# Altium schematic sheet PowerDelivery.SchDoc
size B; SheetNumber: 7; SheetTotal: 7
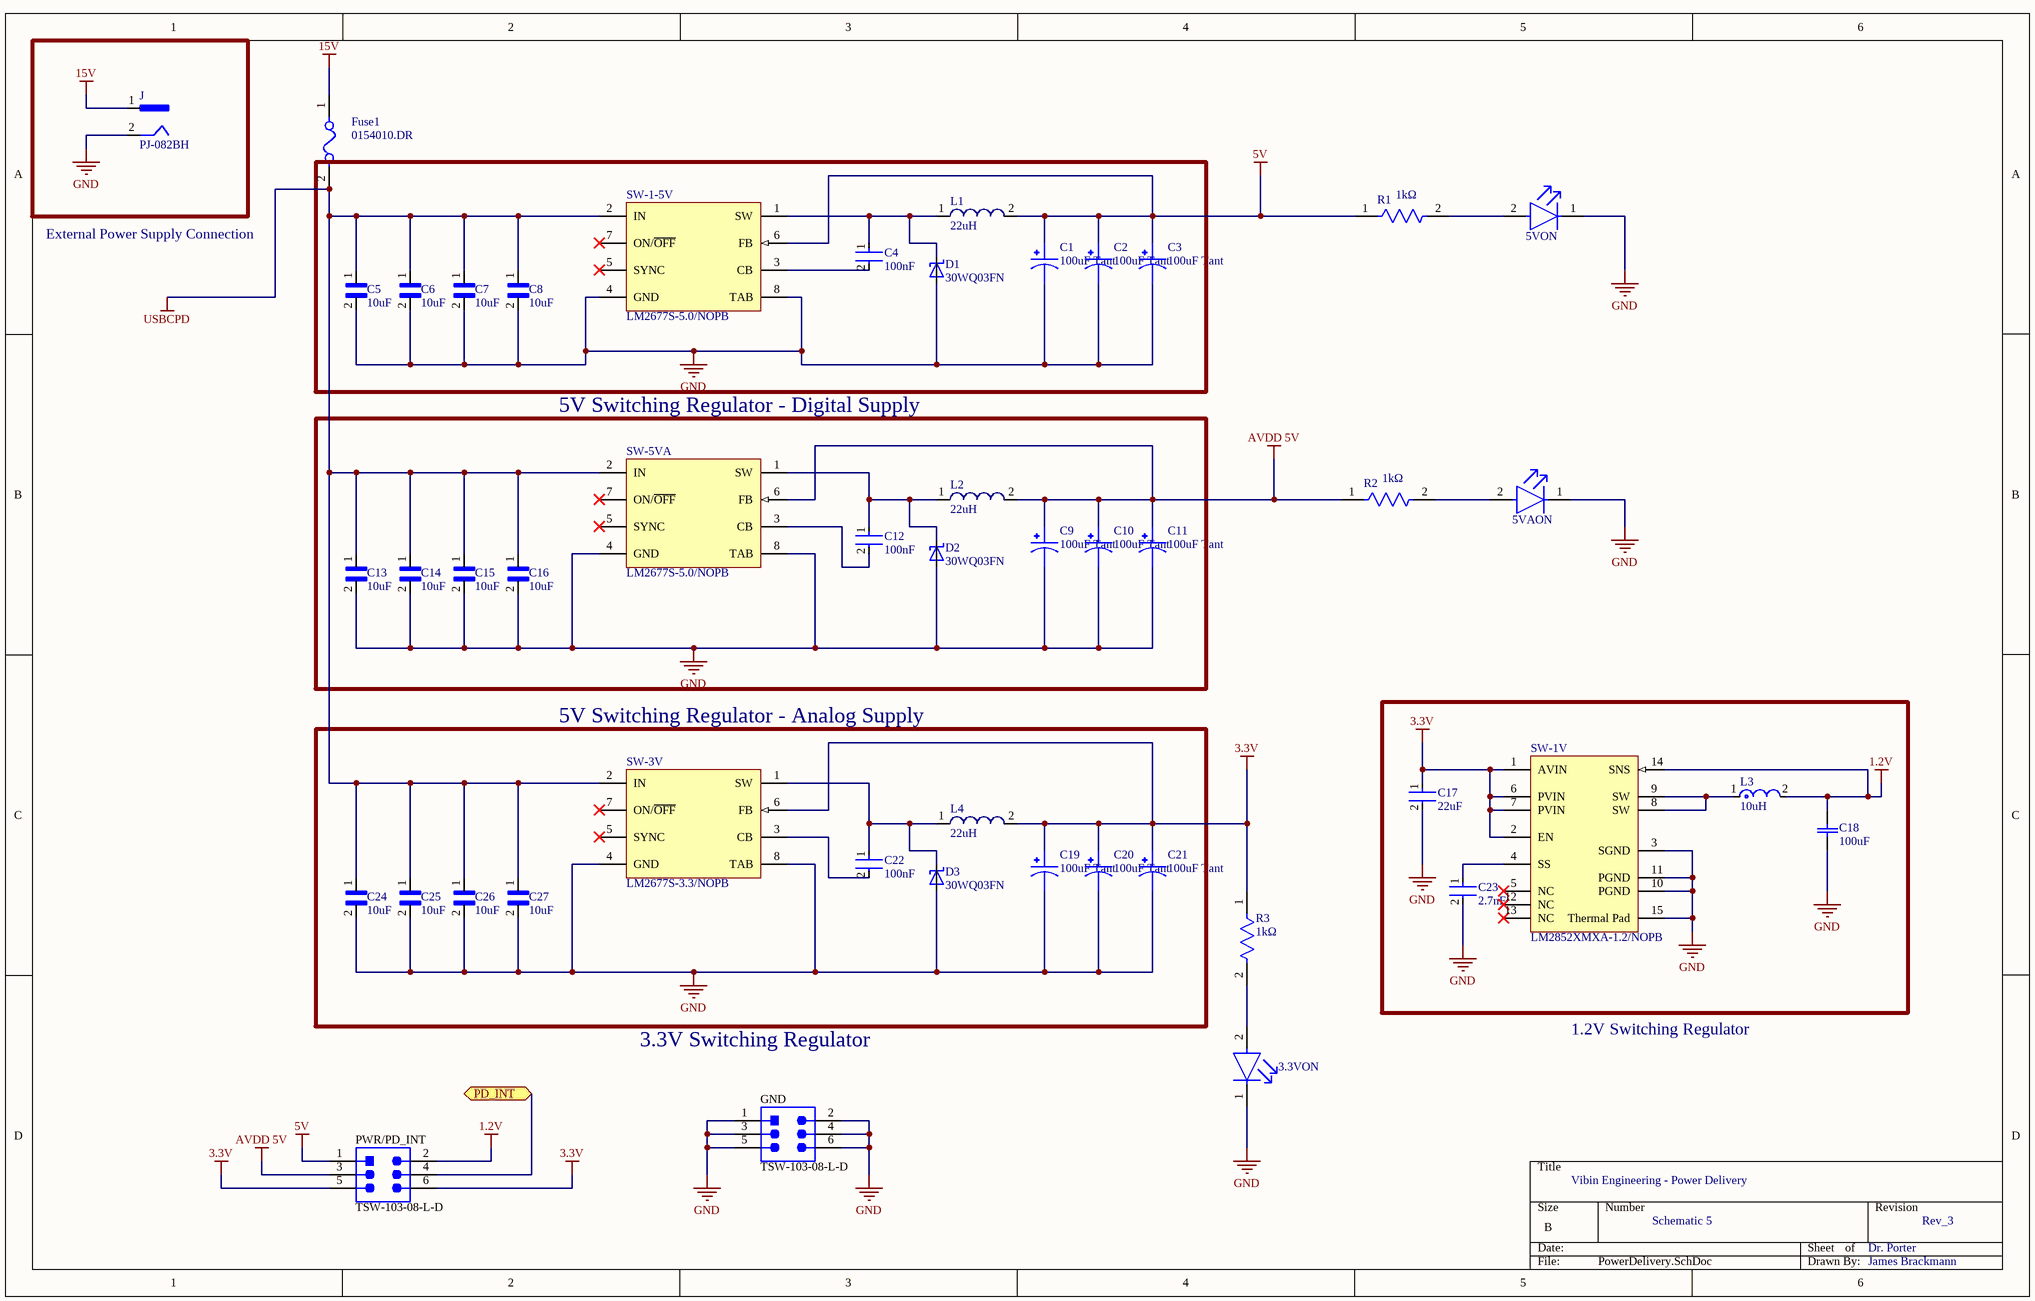
[diagram p0: PowerDelivery.SchDoc]

## Parts
3.3VON  LTST-C190GKT  [FP-LTST-C190GKT-MFG]  (value not drawn)
5VAON  LTST-C190GKT  [FP-LTST-C190GKT-MFG]  (value not drawn)
5VON  LTST-C190GKT  [FP-LTST-C190GKT-MFG]  (value not drawn)
C1  100uF Tant  [CAPPM7343X310N]
C2  100uF Tant  [CAPPM7343X310N]
C3  100uF Tant  [CAPPM7343X310N]
C4  100nF  [FP-CC0603-DA-MFG]
C5  10uF  [CAPPM7343X310N]
C6  10uF  [CAPPM7343X310N]
C7  10uF  [CAPPM7343X310N]
C8  10uF  [CAPPM7343X310N]
C9  100uF Tant  [CAPPM7343X310N]
C10  100uF Tant  [CAPPM7343X310N]
C11  100uF Tant  [CAPPM7343X310N]
C12  100nF  [FP-CC0603-DA-MFG]
C13  10uF  [CAPPM7343X310N]
C14  10uF  [CAPPM7343X310N]
C15  10uF  [CAPPM7343X310N]
C16  10uF  [CAPPM7343X310N]
C17  22uF  [FP-GRM21B-0_15-MFG]
C18  100uF  [CAPCP3216X180N]
C19  100uF Tant  [CAPPM7343X310N]
C20  100uF Tant  [CAPPM7343X310N]
C21  100uF Tant  [CAPPM7343X310N]
C22  100nF  [FP-CC0603-DA-MFG]
C23  2.7nF  [FP-C0402-BB-MFG]
C24  10uF  [CAPPM7343X310N]
C25  10uF  [CAPPM7343X310N]
C26  10uF  [CAPPM7343X310N]
C27  10uF  [CAPPM7343X310N]
D1  30WQ03FN  [TO-252AA]
D2  30WQ03FN  [TO-252AA]
D3  30WQ03FN  [TO-252AA]
Fuse1  0154010.DR  [FP-0154-MFG]
GND  TSW-103-08-L-D  [SMTC-TSW-103-08-L-D_V]
J  PJ-082BH  [CUI_PJ-082BH]
L1  22uH  [WE-PD2SR 7850]
L2  22uH  [WE-PD2SR 7850]
L3  10uH  [FP-DEM8045C-MFG]
L4  22uH  [WE-PD2SR 7850]
PWR/PD_INT  TSW-103-08-L-D  [SMTC-TSW-103-08-L-D_V]
R1  1kΩ  [FP-CRCW0603-e3-MFG]
R2  1kΩ  [FP-CRCW0603-e3-MFG]
R3  1kΩ  [FP-CRCW0603-e3-MFG]
SW-1-5V  LM2677S-5.0/NOPB  [KTW0007B_N]
SW-1V  LM2852XMXA-1.2/NOPB  [MXA14A_M]
SW-3V  LM2677S-3.3/NOPB  [KTW0007B_M]
SW-5VA  LM2677S-5.0/NOPB  [KTW0007B_N]

## Blocks framed on the sheet
5V Switching Regulator - Digital Supply: C9-C16 D2 L2 SW-5VA
5V Switching Regulator - Analog Supply: C19-C22 C24-C27 D3 L4 SW-3V

## Ports
PD_INT (bidir)

## Nets
1.2V: C18.2(C2) L3.2 PWR/PD_INT.2 SW-1V.14(SNS)
3.3V: C17.1 C19.1 C20.1 C21.1 L4.2 PWR/PD_INT.5 PWR/PD_INT.6 R3.1 SW-1V.1(AVIN) SW-1V.2(EN) SW-1V.6(PVIN) SW-1V.7(PVIN) SW-3V.6(FB)
5V: C1.1 C2.1 C3.1 L1.2 PWR/PD_INT.1 R1.1 SW-1-5V.6(FB)
15V: Fuse1.1 J.1
AVDD 5V: C9.1 C10.1 C11.1 L2.2 PWR/PD_INT.3 R2.1 SW-5VA.6(FB)
GND: 3.3VON.1(C) 5VAON.1(C) 5VON.1(C) C1.2 C2.2 C3.2 C5.2 C6.2 C7.2 C8.2 C9.2 C10.2 C11.2 C13.2 C14.2 C15.2 C16.2 C17.2 C18.1(C1) C19.2 C20.2 C21.2 C23.2 C24.2 C25.2 C26.2 C27.2 D1.1(A1) D2.1(A1) D3.1(A1) GND.1 GND.2 GND.3 GND.4 GND.5 GND.6 J.2 SW-1-5V.4(GND) SW-1-5V.8(TAB) SW-1V.3(SGND) SW-1V.10(PGND) SW-1V.11(PGND) SW-1V.15(Thermal_Pad) SW-3V.4(GND) SW-3V.8(TAB) SW-5VA.4(GND) SW-5VA.8(TAB)
USBCPD: C5.1 C6.1 C7.1 C8.1 C13.1 C14.1 C15.1 C16.1 C24.1 C25.1 C26.1 C27.1 Fuse1.2 SW-1-5V.2(IN) SW-3V.2(IN) SW-5VA.2(IN)
PD_INT: PWR/PD_INT.4 ; port PD_INT
Net3.3VON_2: 3.3VON.2(A) R3.2
Net5VAON_2: 5VAON.2(A) R2.2
Net5VON_2: 5VON.2(A) R1.2
NetC4_1: C4.1 D1.3(C) L1.1 SW-1-5V.1(SW)
NetC4_2: C4.2 SW-1-5V.3(CB)
NetC12_1: C12.1 D2.3(C) L2.1 SW-5VA.1(SW)
NetC12_2: C12.2 SW-5VA.3(CB)
NetC22_1: C22.1 D3.3(C) L4.1 SW-3V.1(SW)
NetC22_2: C22.2 SW-3V.3(CB)
NetC23_1: C23.1 SW-1V.4(SS)
NetL3_1: L3.1 SW-1V.8(SW) SW-1V.9(SW)

Not connected (* = marked no-connect by the designer): D1 2(A2); D2 2(A2); D3 2(A2); SW-1-5V 5(SYNC)* 7(ON/~{OFF})*; SW-1V 5(NC)* 12(NC)* 13(NC)*; SW-3V 5(SYNC)* 7(ON/~{OFF})*; SW-5VA 5(SYNC)* 7(ON/~{OFF})*

## Notes on the sheet
- External Power Supply Connection
- 3.3V Switching Regulator
- 1.2V Switching Regulator
- Vibin Engineering - Power Delivery
- Schematic 5
- Dr. Porter
- Rev_3
- James Brackmann

## Library data of the parts
3.3VON 5VAON 5VON = CMP-22017-000005-2: LED GREEN CLEAR CHIP SMD       LTST-C190GKT; Dominant Wavelength: 569nm; Reverse Voltage: 5V; Lens Color: Colorless; Viewing Angle: 130°; Voltage: 2V; Forward Current: 30mA; Power Dissipation: 100mW; Luminous Intensity: 6mcd; Number of LEDs: 1; Forward Voltage: 2.1V; Wavelength: 565nm; Test Current: 10mA; Min Operating Temperature: -55°C; Lens Style: Clear; Mount: Surface Mount; Width: 0.8mm; Packaging: Tape and Reel; Lens Transparency: Clear; Case Code (Metric): 1608; Depth: 0.8mm; Case Code (Imperial): 0603; Case/Package: 0603; Number of Pins: 2; Max Operating Temperature: 85°C; Lead Free: Lead Free; Number of Elements: 1; Length: 1.6mm; Height: 0.8mm; Package Quantity: 1; Power Rating: 100mW; Radiation Hardening: No; Illumination Color: Green; Color: Green
C1 C9 C19 = TPSD107K010R0065: 100 ÂµF Molded Tantalum Capacitors 10 V 2917 (7343 Metric) 65mOhm / TPSD107K010R0065; MF: AVX; Check_prices: https://www.snapeda.com/parts/TPSD107K010R0065/AVX/view-part/?ref=eda; SnapEDA_Link: https://www.snapeda.com/parts/TPSD107K010R0065/AVX/view-part/?ref=snap; Package: 2917 AVX; Value: *; MP: TPSD107K010R0065; Digi-Key_Part_Number: 478-1776-2-ND; Purchase-URL: https://pricing.snapeda.com/search/part/TPSD107K010R0065/?ref=eda
C2 C3 C10 C11 C20 C21 = TPSD107K010R0065: 100 ÂµF Molded Tantalum Capacitors 10 V 2917 (7343 Metric) 65mOhm; MF: AVX; Check_prices: https://www.snapeda.com/parts/TPSD107K010R0065/AVX/view-part/?ref=eda; SnapEDA_Link: https://www.snapeda.com/parts/TPSD107K010R0065/AVX/view-part/?ref=snap; Package: 2917 AVX; Value: *; MP: TPSD107K010R0065; Digi-Key_Part_Number: 478-1776-2-ND; Purchase-URL: https://pricing.snapeda.com/search/part/TPSD107K010R0065/?ref=eda
C4 C12 C22 = CMP-2100-03600-2: CAP CER 10000PF 50V X7R 0603      CC0603KRX7R9BB103; Manufacturer: YAGEO; Tolerance: 0.1; Material: Ceramic; Temperature Coefficient: 15%; Value: 10 nF; Mouser Description: Multilayer Ceramic Capacitor, CC Series, 0.01 - F, - 10%, X7R, 50 V, 0603 [1608 Metric]; Digikey Description: CAP CER 10000PF 50V X7R 0603; Height: 0.9mm; Category: Cap; Temperature Characteristic: X7R; Footprint Url: http://www.yageo.com/exep/pages/download/literatures/UPY-C_GEN_24.pdf; Lead Free: Yes; Voltage Rating: 50 V; Manufacturer Part Number: CC0603KRX7R9BB103; Temperature: -55°C to +125°C; Device Class L3: Ceramic Capacitors; ComponentLink2Description: Datasheet; Voltage: 50 V; Package: CC0603-DA; Octopart: https://octopart.com/cc0603krx7r9bb103-yageo-192938; Automotive: No; Temperature Range High: +125°C; Temperature Range Low: -55°C; RoHS: TRUE; Device Class L1: Passive Components; ComponentLink2URL: http://www.yageo.com/documents/recent/UPY-GPHC_X7R_6.3V-to-50V_18.pdf; Device Class L2: Capacitors; Capacitance: 10 nF
C5-C8 C13-C16 C24-C27 = T495D106M035ATE300: Cap Tant Solid 10uF 35V D CASE 20% _7.3 X 4.3 X 2.8mm_ SMD 7343-31 0.3 Ohm 125C Automotive T/R      T495D106M035ATE300; MF: Kemet; SnapEDA_Link: https://www.snapeda.com/parts/T495D106M035ATE300/Kemet/view-part/560949/?ref=snap; MP: T495D106M035ATE300; Price: None; Value: *; Availability: Unavailable; Package: 2917 Kemet
C17 = CMP-2007-03385-2: Chip Multilayer Ceramic Capacitors for General Purpose, 0805, 22uF, X5R, 15%, 20%, 6.3V       GRM21BR60J226ME39L; Material: Ceramic; Max Operating Temperature: 85°C; Voltage: 6.3V; Min Operating Temperature: -55°C; Case/Package: 0805; Thickness: 0.053inch; Dielectric: X5R; Packaging: Tape and Reel; Depth: 1.25mm; Termination: SMD/SMT; Voltage Rating (DC): 6.3V; Radiation Hardening: No; Tolerance: 20%; Mount: Surface Mount; Lead Free: Lead Free; Package Quantity: 1; REACH SVHC: No SVHC; Voltage Rating: 6.3V; Capacitance: 22uF; Length: 2mm; Case Code (Imperial): 0805; Case Code (Metric): 2012; Width: 0.049inch; Height: 1.25mm
C18 = TCJA107M004R0200: 100ÂµF Molded Tantalum Polymer Capacitor 4V 1206 (3216 Metric) 200mOhm @ 100kHz          TCJA107M004R0200; MF: AVX; Check_prices: https://www.snapeda.com/parts/TCJA107M004R0200/AVX/view-part/607617/?ref=eda; Availability: In Stock; Price: None; Package: 1206 AVX Corporation; MP: TCJA107M004R0200; Value: *; SnapEDA_Link: https://www.snapeda.com/parts/TCJA107M004R0200/AVX/view-part/607617/?ref=snap; Purchase-URL: https://pricing.snapeda.com/search/part/TCJA107M004R0200/?ref=eda
C23 = CMP-2008-03164-3: C0402 2,700 pF X7R 5.00% 10 V        C0402C272J8RACAUTO; Manufacturer: Kemet; Material: Ceramic; Tolerance: 0.05; Temperature Coefficient: 15%; Voltage Rating: 10 V; Octopart: https://octopart.com/c0402c272j8racauto-kemet-16435644; Manufacturer Part Number: C0402C272J8RACAUTO; Device Class L2: Capacitors; Temperature Range Low: -55°C; Mouser Description: Cap Ceramic 0.0027uF 10V X7R 5% SMD 0402 125°C Bulk; Ipc Land Pattern Name: CAPC10050X50; Device Class L3: Ceramic Capacitors; Lead Free: Yes; Temperature Range High: +125°C; Automotive: No; ComponentLink2URL: https://content.kemet.com/datasheets/KEM_C1002_X7R_SMD.pdf; Temperature: -55°C to +125°C; Height: 0.55mm; RoHS: TRUE; Value: 2,700 pF; Package: C0402-BB; Temperature Characteristic: X7R; Device Class L1: Passive Components; Category: Cap; Capacitance: 2,700 pF; ComponentLink2Description: Datasheet
D1-D3 = 30WQ03FN: DIODE SCHOTTKY 30V 3.5A DPAK        30WQ03FN; MF: Vishay Semiconductor Diodes Division; Price: None; Check_prices: https://www.snapeda.com/parts/30WQ03FN/Vishay%20Semiconductor%20Diodes%20Division/view-part/5366491/?ref=eda; Value: *; Package: None; SnapEDA_Link: https://www.snapeda.com/parts/30WQ03FN/Vishay%20Semiconductor%20Diodes%20Division/view-part/5366491/?ref=snap; MP: 30WQ03FN; Availability: Bad
Fuse1 = CMP-2000-05598-2: FUSE BRD MNT 10A 125VAC/VDC SMD    0154010.DR; Manufacturer: Littelfuse Inc; Fuse Blow Speed: Fast; Max Fuse Dc Voltage: 125V; Digikey Description: FUSE BRD MNT 10A 125VAC/VDC SMD; Mouser Description: Surface Mount Fuses Fuse with Holder 10A FAST OMNI BLOK 154; ComponentLink2Description: Datasheet; Height: 3.81mm; Automotive: No; Category: Fuse; Device Class L3: unset; Package: 0154; Temperature Range High: +125°C; RoHS: TRUE; Temperature Range Low: -55°C; Temperature: -55°C to +125°C; Manufacturer Part Number: 0154010.DR; Fuse Current: 10A; Device Class L2: Fuses; Device Class L1: Circuit Protection; Max Fuse Ac Voltage: 125V; Voltage Rating: 125V; ComponentLink2URL: https://www.littelfuse.com/~/media/electronics/datasheets/fuses/littelfuse_fuse_154_154t_154l_154tl_datasheet.pdf.pdf; Lead Free: Yes; Octopart: https://octopart.com/0154010.dr-littelfuse-565890
GND PWR/PD_INT = CMP-1024-00336-5: Male Header, Pitch 2.54 mm, 2 x 3 Position, Height 8.38 mm, Tail Length 5.08 mm, -55 to 125 degC, RoHS, Bulk; Manufacturer: Samtec; DatasheetVersion: 04/2012; ComponentLink3URL: http://suddendocs.samtec.com/prints/tsw-xxx-xx-x-x-xx-xxx-footprint.pdf; PackageReference: TSW-103-08-L-D; Mounting Technology: Through Hole; Min Operating Temperature: -55 degC; ComponentLink2Description: Datasheet; Lead Pitch: 2.54 mm; ComponentLink1Description: Manufacturer URL; Mount: Through Hole; ComponentLink1URL: http://www.samtec.com/; ComponentLink3Description: Package Specification; Max Operating Temperature: 125 degC; PackageDescription: Male Header, Pitch 2.54 mm, 2 x 3 Position, Height 8.38 mm, Tail Length 5.08 mm; ComponentLink2URL: https://datasheet.ciiva.com/25618/0900766b81154476-25618436.pdf; RoHSCompliant: true
J = PJ-082BH: 2.5 x 6.5 mm, 10.0 A, Horizontal, Through Hole, Shielded, Dc Power Jack Connector; MF: CUI Devices; Price: None; Value: *; Package: None; SnapEDA_Link: https://www.snapeda.com/parts/PJ-082BH/CUI%20Devices/view-part/558054/?ref=snap; Availability: Unavailable; MP: PJ-082BH
L1 L2 L4 = CMP-1397-00009-1: Shielded Power Inductor WE-PD2SR, L=22.0 µH     744787220; Manufacturer: Wuerth Elektronik; Inductance: 22.0 ÂµH; ComponentLink1URL: http://www.we-online.com; PackageReference: WE-PD2SR 7850; PartNumber: 744787220; ComponentLink2URL: http://www.we-online.de/katalog/media/pdf/744787220.pdf; ComponentLink1Description: Manufacturer URL; ComponentLink2Description: Datasheet
L3 = CMP-06042-001560-1: Shielded Wirewound Inductor 10uH 20% 3900mA 0.0396Ω SMD     DEM8045Z-100M=P3
R1-R3 = CMP-1666-00003-5: RES Thick Film, 1kΩ, 1%, 0.1W, 100ppm/°C, 0603; Max Power Dissipation: 100mW; Voltage Rating: 75V; Resistance: 1kR; Max Operating Temperature: 155°C; Number of Pins: 2; Case Code (Imperial): 0603; Width: 0.033inch; Power Rating: 100mW; Number of Terminations: 2; Package Quantity: 10; Weight: 7.1E-05oz; Tolerance: 1%; Temperature Coefficient: 100ppm/°C; Military Standard: Not; Mount: Surface Mount; Voltage Rating (DC): 75V; Depth: 0.85mm; Composition: Thick Film; Radiation Hardening: No; Termination: SMD/SMT; Length: 1.55mm; Case Code (Metric): 1608; Contact Plating: Tin; Min Operating Temperature: -55°C; Packaging: Tape and Reel; Height: 0.45mm; Lead Free: Lead Free; Case/Package: 0603; Features: Automotive AEC-Q200
SW-1-5V SW-5VA = CMP-0069-00212-3: SIMPLE SWITCHER® High Efficiency 5A Step-Down Voltage Regulator with Sync, 7-pin TO-263, Pb-Free     LM2677S-5.0/NOPB; Manufacturer: Texas Instruments; PackageTopMarking: NSUZXYTTE#*LM2677S*-5.0; PowerWise: N; Code_JEDEC: MO-169-AC; ComponentLink1URL: http://www.ti.com/general/docs/lit/getliterature.tsp?genericPartNumber=LM2677&fileType=pdf; PackageReference: KTW0007B; PinCount: 7; RoHS: Y; PackageDescription: TO-263, Molded, .400 x .390 x .180in Body, 7 Lead, .050in Pitch, Surface Mount; ComponentLink1Description: Datasheet URL; CompType: Switcher
SW-1V = CMP-0069-01621-2: 2A 500/1500kHz Synchronous SIMPLE SWITCHER® Buck Regulator, 14-pin TSSOP-EP, Pb-Free    LM2852XMXA-1.2/NOPB; Manufacturer: National Semiconductor; PowerWise: Y; PackageTopMarking: NSUZXYTT*2852X*1.2; RoHS: Y; PinCount: 14; ComponentLink1URL: http://www.national.com/ds/LM/LM2852.pdf; ComponentLink1Description: LM2852 Datasheet; PackageReference: MXA14A; ComponentLink3Description: MXA14A Package Page; PackageVersion: revA, Feb-2003; CompType: Switcher; ComponentLink2URL: http://www.national.com/pf/LM/LM2852.html; RevisionNote: Component URLs added; ComponentLink2Description: LM2852 Web Page; Code_JEDEC: MO-153-ABT-1; ComponentLink3URL: http://www.national.com/packaging/folders/mxa14a.html; DatasheetVersion: Oct-2006; PackageDescription: Molded TSSOP, JEDEC, Exposed Pad, 5.0 x 4.4 x 0.9mm Body, 14 Lead, 0.65mm Pitch
SW-3V = CMP-0069-00200-3: SIMPLE SWITCHER® High Efficiency 5A Step-Down Voltage Regulator with Sync, 7-pin TO-263, Pb-Free        LM2677S-3.3/NOPB; Manufacturer: Texas Instruments; PackageTopMarking: NSUZXYTTE#*LM2677S*-3.3; PowerWise: N; Code_JEDEC: MO-169-AC; CompType: Switcher; ComponentLink1URL: http://www.ti.com/general/docs/lit/getliterature.tsp?genericPartNumber=LM2677&fileType=pdf; PackageDescription: TO-263, Molded, .400 x .390 x .180in Body, 7 Lead, .050in Pitch, Surface Mount; PinCount: 7; ComponentLink1Description: Datasheet URL; RoHS: Y; PackageReference: KTW0007B